# Altium schematic sheet Sensor inputs.SchDoc
size A4; SheetNumber: 4; SheetTotal: 5
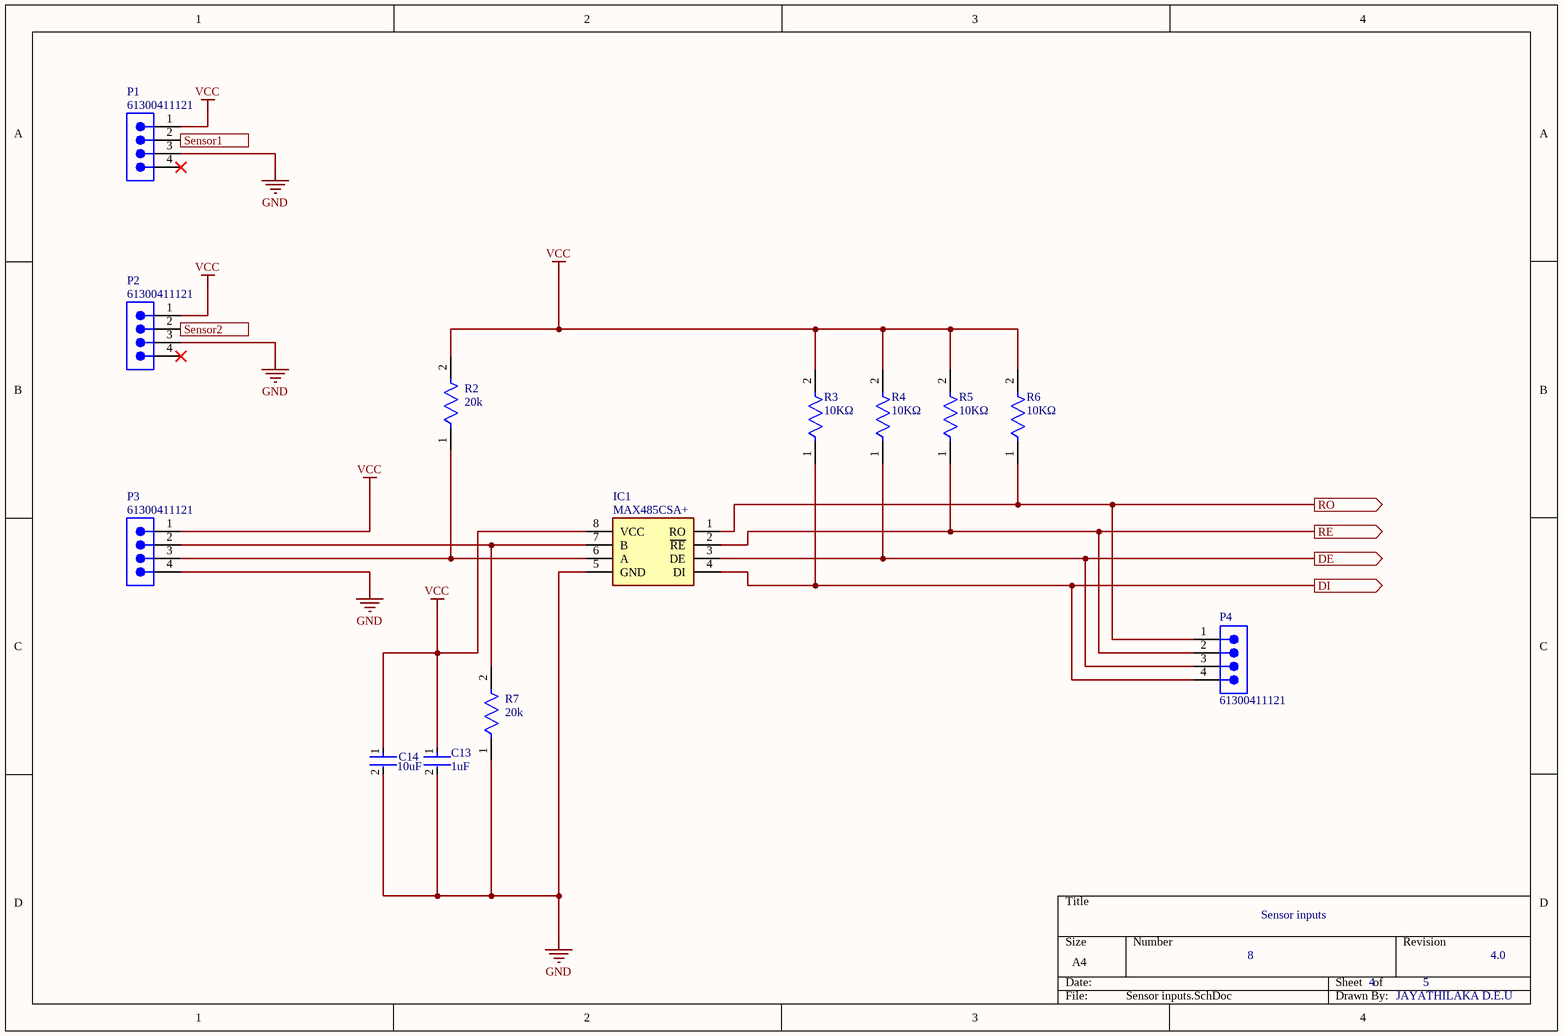
[diagram p0: Sensor inputs.SchDoc]

## Parts
C13  Capacitance: 1uF  [FP-1206-L_3_2_0_2-W_1_6_0-IPC_A]  (hidden comment: 12061C105K4T2A)
C14  value 10uF  [FP-CL31B106KBHNNNE-MFG]  (hidden comment: CL31B106KBHNNNE)
IC1  MAX485CSA+  [SOIC127P600X175-8N]
P1  61300411121  [61300411121]
P2  61300411121  [61300411121]
P3  61300411121  [61300411121]
P4  61300411121  [61300411121]
R2  Resistance: 20k  [FP-ERA8A-IPC_A]  (hidden comment: ERA8AEB203V)
R3  Resistance: 10KΩ  [FP-RT1206-MFG]  (hidden comment: RT1206BRD0710KL)
R4  Resistance: 10KΩ  [FP-RT1206-MFG]  (hidden comment: RT1206BRD0710KL)
R5  Resistance: 10KΩ  [FP-RT1206-MFG]  (hidden comment: RT1206BRD0710KL)
R6  Resistance: 10KΩ  [FP-RT1206-MFG]  (hidden comment: RT1206BRD0710KL)
R7  Resistance: 20k  [FP-ERA8A-IPC_A]  (hidden comment: ERA8AEB203V)

## Ports
DE (out, see Farm Assistor[1B], MCU[2C]), DI (out, see Farm Assistor[1B], MCU[2B]), RE (out, see Farm Assistor[1B], MCU[2C]), RO (out, see Farm Assistor[1B], MCU[2B]), Sensor1 (out, see Farm Assistor[1B], MCU[2B]), Sensor2 (out, see Farm Assistor[1B], MCU[2B])

## Nets
GND: C13.2 C14.2 IC1.5(GND) P1.3 P2.3 P3.4 R7.1
VCC: C13.1 C14.1 IC1.8(VCC) P1.1 P2.1 P3.1 R2.2 R3.2 R4.2 R5.2 R6.2
DE: IC1.3(DE) P4.3 R4.1 ; port DE
DI: IC1.4(DI) P4.4 R3.1 ; port DI
RE: IC1.2(~{RE}) P4.2 R5.1 ; port RE
RO: IC1.1(RO) P4.1 R6.1 ; port RO
Sensor1: P1.2 ; port Sensor1
Sensor2: P2.2 ; port Sensor2
NetIC1_6: IC1.6(A) P3.3 R2.1
NetIC1_7: IC1.7(B) P3.2 R7.2

Not connected (* = marked no-connect by the designer): P1 4*; P2 4*

## Notes on the sheet
- Sensor inputs
- 8
- 4
- 5
- 4.0
- JAYATHILAKA D.E.U

## Library data of the parts
C13 = CMP-04427-018965-1: Automotive Ceramic Capacitor, 1206, 1uF, 10%, X7R, 15%,; Voltage Rating (DC): 100V; Thickness: 0.06inch; Min Operating Temperature: -55°C; Lead Free: Lead Free; Width: 0.063inch; Length: 3.2mm; Ratings: AEC-Q200; Mount: Surface Mount; Depth: 1.6mm; Construction: Flat; Height: 0.94mm; Tolerance: 10%; Case Code (Metric): 3216; Case Code (Imperial): 1206; Dielectric: X7R; Case/Package: 1206; REACH SVHC: No SVHC; Voltage Rating: 100V; RoHS Compliant: Yes; Max Operating Temperature: 125°C; Termination: SMD/SMT; Radiation Hardening: No; Packaging: Tape and Reel; Series: -; Weight: 0.000571oz
C14 = CMP-2000-07530-2: CAP CER 10UF 50V X7R 1206; Manufacturer: Samsung; Tolerance: 10%; Material: Ceramic; Temperature Coefficient: 15%; Temperature Characteristic: X7R; Digikey Description: CAP CER 10UF 50V X7R 1206; Device Class L1: Passive Components; Lead Free: Yes; Device Class L3: Ceramic Capacitors; Octopart: https://octopart.com/cl31b106kbhnnne-samsung-30507377; ComponentLink2URL: http://www.samsungsem.com/global/front/downloadcms.do?path=%2F%2Fglobal%2F%2Fsupport%2F%2Fproduct-search%2F%2Fmlcc%2F%2F__icsFiles%2F%2Fafieldfile%2F%2F2019%2F%2F06%2F%2F18&fileName=CL31B106KBHNNNE-19.pdf; Voltage Rating: 50V; Temperature Range Low: -55°C; RoHS: TRUE; Temperature: -55°C to +125°C; Category: Cap; ComponentLink2Description: Datasheet; Manufacturer Part Number: CL31B106KBHNNNE; Automotive: No; Device Class L2: Capacitors; Capacitance: 10uF; Height: 1.8mm; Temperature Range High: +125°C; Package: CL31B106KBHNNNE
IC1 = MAX485CSA+: Integrated Circuit; Manufacturer_Name: Analog Devices; Datasheet Link: http://datasheets.maximintegrated.com/en/ds/MAX1487-MAX491.pdf; Height: 1.75mm; Manufacturer_Part_Number: MAX485CSA+; Mouser Part Number: 700-MAX485CSA; Mouser Price/Stock: https://www.mouser.co.uk/ProductDetail/Analog-Devices-Maxim-Integrated/MAX485CSA%2b?qs=1THa7WoU59EQmpurcwoy4Q%3D%3D; Arrow Part Number: MAX485CSA+; Arrow Price/Stock: https://www.arrow.com/en/products/max485csa/analog-devices?region=nac
P1-P4 = CMP-1502-01064-2: NexarPartId: 32855522; Pitch: 2.54mm; Number of Contacts: 4; Contact Resistance: 20mΩ; Gender: Male; Current Rating: 3A; Connector Type: Male Pin; Voltage Rating: 250V; Lead Free: Lead Free; Contact Plating: Gold; Max Operating Temperature: 105°C; Packaging: Bulk; Height: 8.89mm; Orientation: Vertical; Contact Mating Length: 5.9944mm; Contact Material: Copper; Lead Pitch: 2.54mm; Min Operating Temperature: -40°C; Termination: Solder; Color: Black; Number of Rows: 1; REACH SVHC: Unknown; RoHS: Compliant; Mount: Through Hole; Number of Positions: 4; Number of Pins: 4; Operating Supply Voltage: 250V
R2 R7 = CMP-2003-04436-2: RES SMD 20K OHM 0.1% 1/4W 1206; Voltage Rating (DC): 150V; Max Power Dissipation: 250mW; Temperature Coefficient: 25ppm/°C; Resistance Tolerance: 0.1%; Case Code (Metric): 3216; Max Operating Temperature: 155°C; Min Operating Temperature: -55°C; Length: 3.2mm; Technology: THIN FILM; Package Quantity: 5000; Number of Terminations: 2; Military Standard: Not; Contact Plating: Tin; Case Code (Imperial): 1206; Lead Free: Lead Free; Height: 0.6mm; Construction: Rectangular; Mount: Surface Mount; REACH SVHC: No SVHC; Series: ERA-8A; RoHS Compliant: Yes; Power Rating: 250mW; Tolerance: 0.1%; Radiation Hardening: No; Voltage Rating: 150V; Case/Package: 1206; Resistor Type: Metal Film; Termination: SMD/SMT; Packaging: Tape and Reel; Depth: 1.6mm; Number of Pins: 2; Width: 0.063inch; Parameter 1: *
R3-R6 = CMP-2003-04273-2: RES 10.0K OHM 1/4W .1% SMD 1206; Manufacturer: Yageo; Power Rating: 0.25W; Temperature Coefficient: 25 ppm/°C; Voltage Rating: 200V; Value: 10KΩ; Tolerance: 0.005; ComponentLink2URL: http://www.yageo.com/documents/recent/PYu-RT_1-to-0.01_RoHS_L_9.pdf; ComponentLink2Description: Datasheet; Series: RT; Octopart: https://octopart.com/rt1206brd0710kl-yageo-1397513; Footprint Url: http://www.yageo.com/exep/pages/download/literatures/PYu-R_Mount_10.pdf; Manufacturer Part Number: RT1206BRD0710KL; Temperature: -55°C to +155°C; Digikey Description: RES 10.0K OHM 1/4W .1% SMD 1206; Ipc Land Pattern Name: RESC310160X55; Temperature Range Low: -55°C; Mouser Description: High Precision-High Stability Chip Resistor Thin Film 1206 10kOhm 0.1% Paper T/R; Composition: Thin Film; Category: Res; Temperature Range High: +155°C; Device Class L1: Passive Components; Height: 0.65mm; Package: RT1206; Lead Free: Yes; RoHS: TRUE; Device Class L2: Resistors; Device Class L3: Chip SMD Resistors; Automotive: No